# Altium schematic sheet sram.SchDoc
size A4
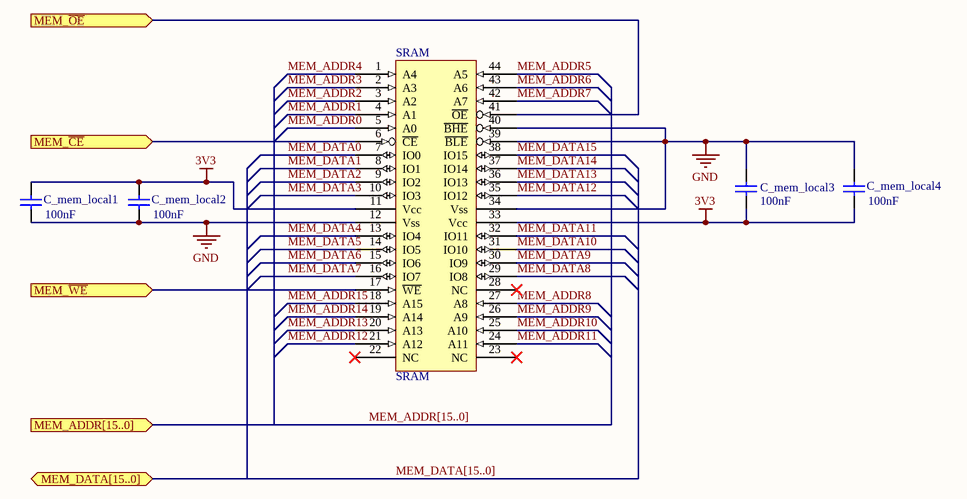
[diagram p0: sram.SchDoc]

## Parts
C_mem_local1  value 100nF  [0805]  (hidden comment: Cap Semi)
C_mem_local2  value 100nF  [0805]  (hidden comment: Cap Semi)
C_mem_local3  value 100nF  [0805]  (hidden comment: Cap Semi)
C_mem_local4  value 100nF  [0805]  (hidden comment: Cap Semi)
SRAM  SRAM  [TSOP44]

## Ports
MEM_ADDR[15..0] (in), MEM_DATA[15..0] (bidir), MEM_~{CE} (in), MEM_~{OE} (in), MEM_~{WE} (in)

## Nets
3V3: C_mem_local1.2 C_mem_local2.2 C_mem_local3.1 C_mem_local4.1 SRAM.11(Vcc) SRAM.33(Vcc)
GND: C_mem_local1.1 C_mem_local2.1 C_mem_local3.2 C_mem_local4.2 SRAM.12(Vss) SRAM.34(Vss) SRAM.39(~{BLE}) SRAM.40(~{BHE})
MEM_ADDR0: SRAM.5(A0)
MEM_ADDR1: SRAM.4(A1)
MEM_ADDR2: SRAM.3(A2)
MEM_ADDR3: SRAM.2(A3)
MEM_ADDR4: SRAM.1(A4)
MEM_ADDR5: SRAM.44(A5)
MEM_ADDR6: SRAM.43(A6)
MEM_ADDR7: SRAM.42(A7)
MEM_ADDR8: SRAM.27(A8)
MEM_ADDR9: SRAM.26(A9)
MEM_ADDR10: SRAM.25(A10)
MEM_ADDR11: SRAM.24(A11)
MEM_ADDR12: SRAM.21(A12)
MEM_ADDR13: SRAM.20(A13)
MEM_ADDR14: SRAM.19(A14)
MEM_ADDR15: SRAM.18(A15)
MEM_~{CE}: SRAM.6(~{CE}) ; port MEM_~{CE}
MEM_DATA0: SRAM.7(IO0)
MEM_DATA1: SRAM.8(IO1)
MEM_DATA2: SRAM.9(IO2)
MEM_DATA3: SRAM.10(IO3)
MEM_DATA4: SRAM.13(IO4)
MEM_DATA5: SRAM.14(IO5)
MEM_DATA6: SRAM.15(IO6)
MEM_DATA7: SRAM.16(IO7)
MEM_DATA8: SRAM.29(IO8)
MEM_DATA9: SRAM.30(IO9)
MEM_DATA10: SRAM.31(IO10)
MEM_DATA11: SRAM.32(IO11)
MEM_DATA12: SRAM.35(IO12)
MEM_DATA13: SRAM.36(IO13)
MEM_DATA14: SRAM.37(IO14)
MEM_DATA15: SRAM.38(IO15)
MEM_~{OE}: SRAM.41(~{OE}) ; port MEM_~{OE}
MEM_~{WE}: SRAM.17(~{WE}) ; port MEM_~{WE}

Not connected (* = marked no-connect by the designer): SRAM 22(NC)* 23(NC)* 28(NC)*

## Buses and harness runs
bus MEM_ADDR[15..0] = port MEM_ADDR[15..0]
bus MEM_DATA[15..0] = port MEM_DATA[15..0]

## Library data of the parts
C_mem_local1-C_mem_local4 = Cap Semi: Capacitor (Semiconductor SIM Model); Published: 8-Jun-2000; LatestRevisionDate: 29-May-2009; LatestRevisionNote: IPC-7351 Footprint Added.; PackageReference: C1206; Publisher: Altium Limited; PackageDescription: Chip Capacitor